# EAGLE schematic PowerController (EAGLE 6.6.0)

## Sheet 1 of 2: MCU
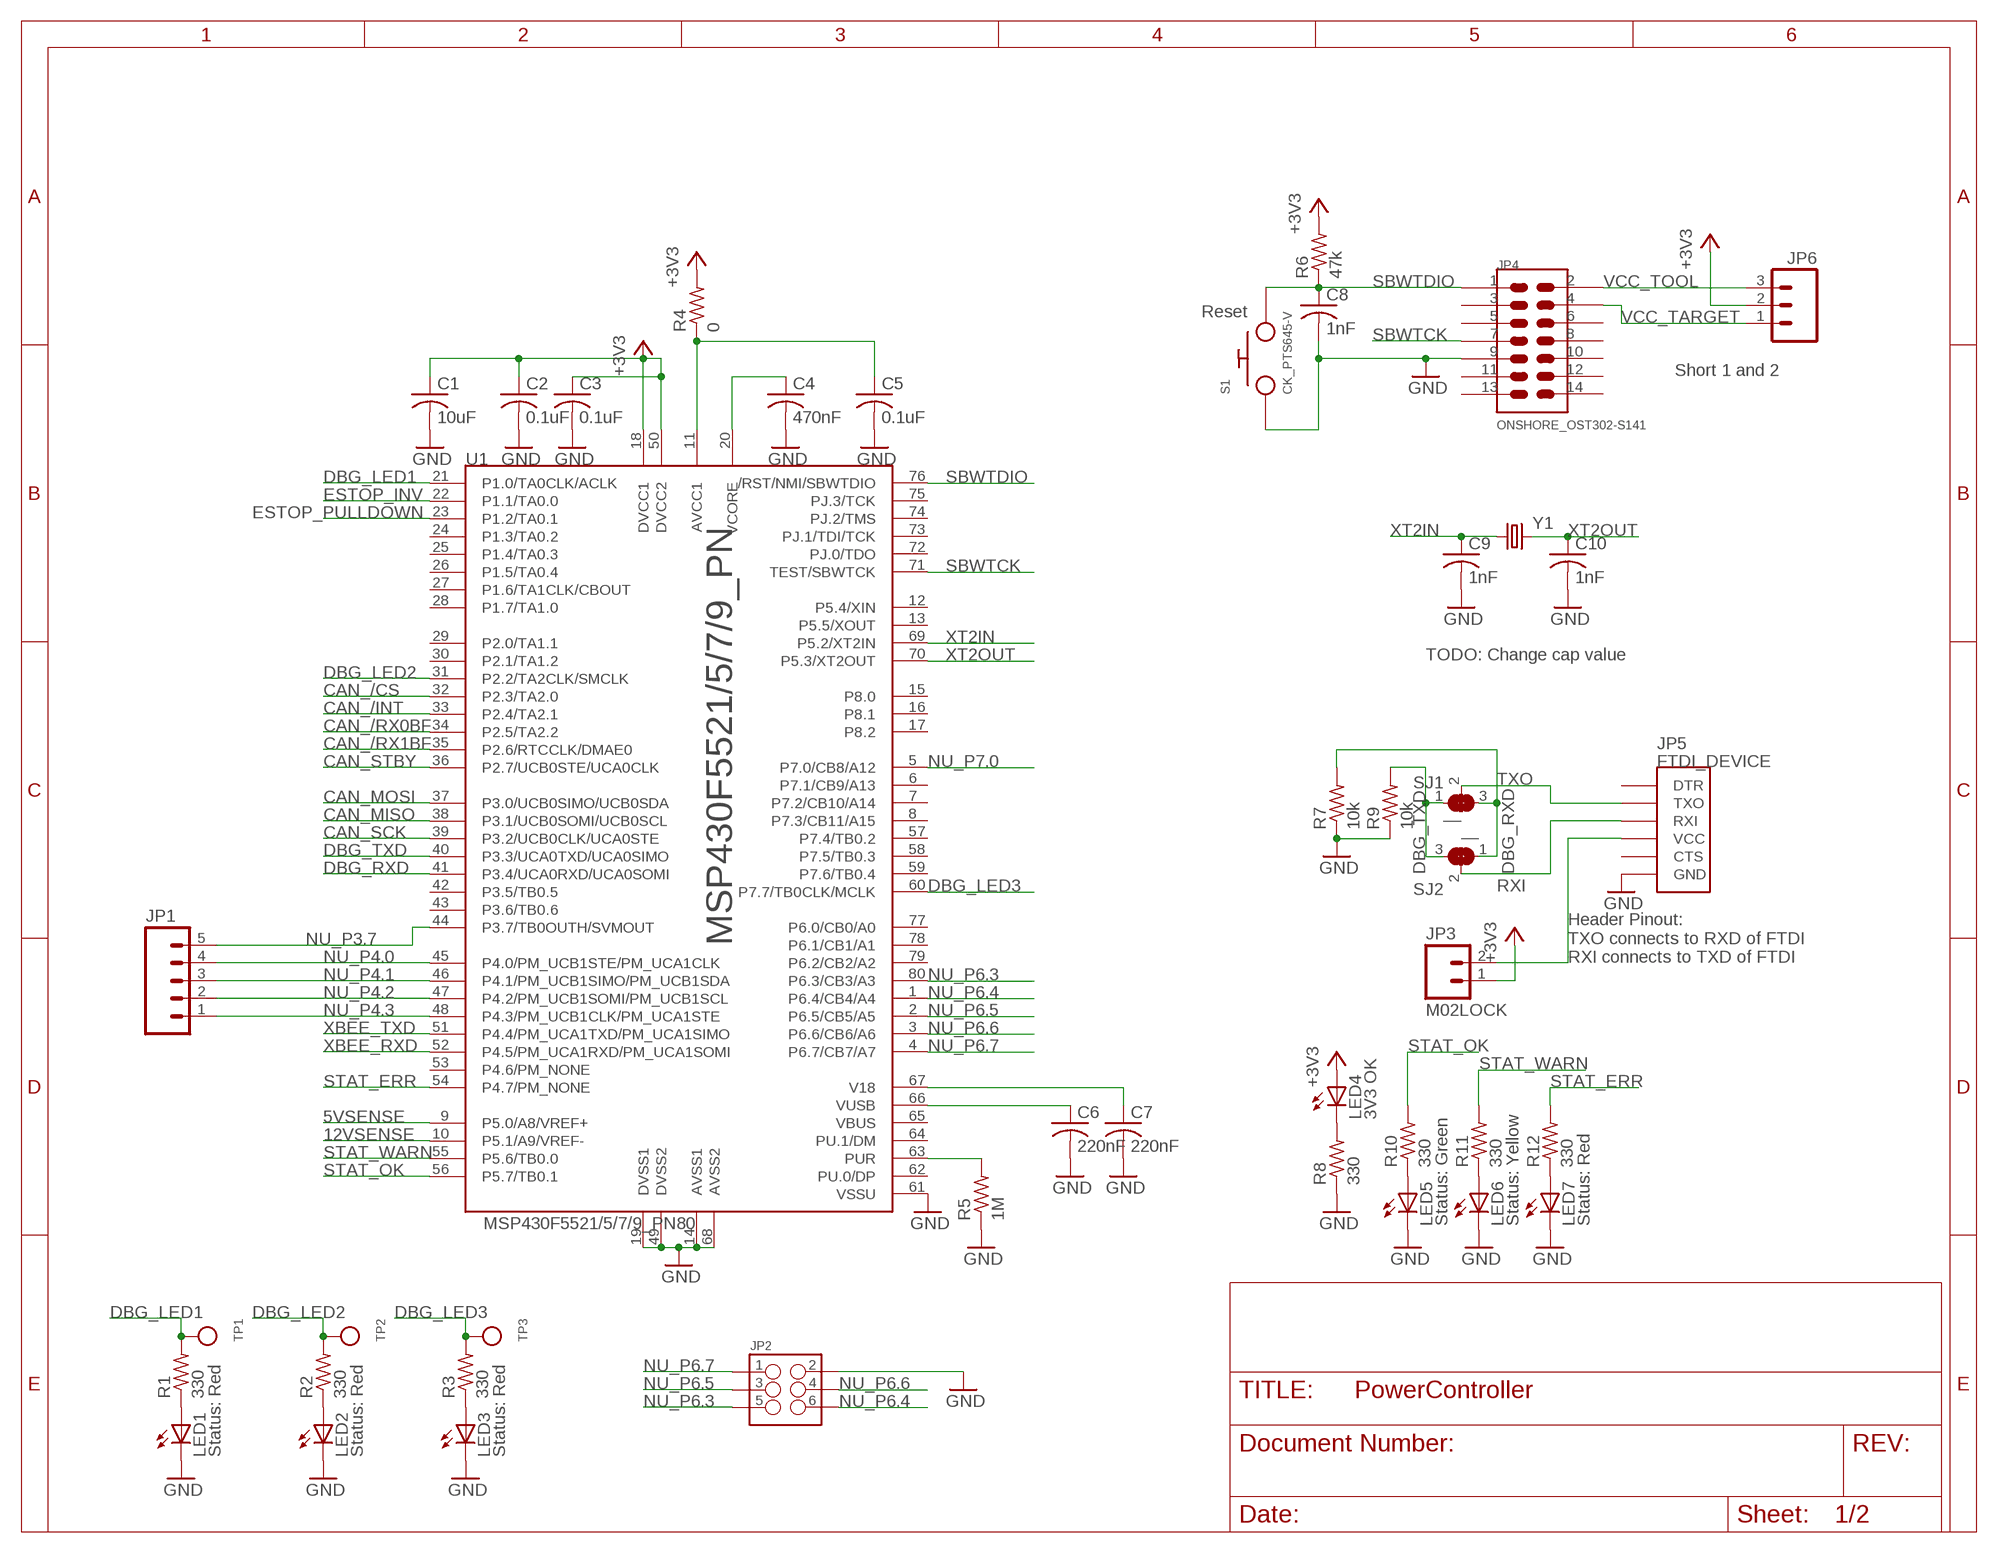
[diagram p0: schematic, sheet 1]

### Parts
C1  10uF  C-USC0805  [C0805]
C2  0.1uF  C-USC0603  [C0603]
C3  0.1uF  C-USC0603  [C0603]
C4  470nF  C-USC0603  [C0603]
C5  0.1uF  C-USC0603  [C0603]
C6  220nF  C-USC0603  [C0603]
C7  220nF  C-USC0603  [C0603]
C8  1nF  C-USC0603  [C0603]
C9  1nF  C-USC0603  [C0603]
C10  1nF  C-USC0603  [C0603]
JP1  M05PTH  [1X05]
JP2  M03X22X3_SILK_SM  [2X3]
JP3  M02LOCK  [1X02_LOCK]
JP4  ONSHORE_OST302-S141  [ONSHORE_OST302-S141]
JP5  FTDI_DEVICE  [FTDI_DEVICE_SIDE]
JP6  M03LOCK  [1X03_LOCK]
LED1  Status: Red  LED0603  [LED-0603]
LED2  Status: Red  LED0603  [LED-0603]
LED3  Status: Red  LED0603  [LED-0603]
LED4  3V3 OK  LED0603  [LED-0603]
LED5  Status: Green  LED0603  [LED-0603]
LED6  Status: Yellow  LED0603  [LED-0603]
LED7  Status: Red  LED0603  [LED-0603]
R1  330  R-US_R0603  [R0603]
R2  330  R-US_R0603  [R0603]
R3  330  R-US_R0603  [R0603]
R4  0  R-US_R0603  [R0603]
R5  1M  R-US_R0603  [R0603]
R6  47k  R-US_R0603  [R0603]
R7  10k  R-US_R0603  [R0603]
R8  330  R-US_R0603  [R0603]
R9  10k  R-US_R0603  [R0603]
R10  330  R-US_R0603  [R0603]
R11  330  R-US_R0603  [R0603]
R12  330  R-US_R0603  [R0603]
S1  CK_PTS645-V  [CK_PTS645-V]
SJ1  SOLDERJUMPER_2WAY0603  [SOLDERJUMPER_2WAY_OPEN_0603]
SJ2  SOLDERJUMPER_2WAY0603  [SOLDERJUMPER_2WAY_OPEN_0603]
TP1  TESTPOINT0.1"  [1X01_ROUND]
TP2  TESTPOINT0.1"  [1X01_ROUND]
TP3  TESTPOINT0.1"  [1X01_ROUND]
U1  MSP430F5521/5/7/9_PN80  [PN80]
Y1  CRYSTALHC49UV  [HC49U-V]

### Nets
5VSENSE: U1.9(P5.0/A8/VREF+) ; also sheet 2
12VSENSE: U1.10(P5.1/A9/VREF-) ; also sheet 2
+3V3: C1.1 C2.1 C3.1 JP3.1 JP6.2 LED4.A R4.2 R6.2 U1.18(DVCC1) U1.50(DVCC2) ; also sheet 2
AVCC: C5.1 R4.1 U1.11(AVCC1)
CAN_/CS: U1.32(P2.3/TA2.0) ; also sheet 2
CAN_/INT: U1.33(P2.4/TA2.1) ; also sheet 2
CAN_/RX0BF: U1.34(P2.5/TA2.2) ; also sheet 2
CAN_/RX1BF: U1.35(P2.6/RTCCLK/DMAE0) ; also sheet 2
CAN_MISO: U1.38(P3.1/UCB0SOMI/UCB0SCL) ; also sheet 2
CAN_MOSI: U1.37(P3.0/UCB0SIMO/UCB0SDA) ; also sheet 2
CAN_SCK: U1.39(P3.2/UCB0CLK/UCA0STE) ; also sheet 2
CAN_STBY: U1.36(P2.7/UCB0STE/UCA0CLK) ; also sheet 2
DBG_LED1: R1.2 TP1.1 U1.21(P1.0/TA0CLK/ACLK)
DBG_LED2: R2.2 TP2.1 U1.31(P2.2/TA2CLK/SMCLK)
DBG_LED3: R3.2 TP3.1 U1.60(P7.7/TB0CLK/MCLK)
DBG_RXD: R7.2 SJ1.3 SJ2.1 U1.41(P3.4/UCA0RXD/UCA0SOMI)
DBG_TXD: R9.2 SJ1.1 SJ2.3 U1.40(P3.3/UCA0TXD/UCA0SIMO)
ESTOP_INV: U1.22(P1.1/TA0.0) ; also sheet 2
ESTOP_PULLDOWN: U1.23(P1.2/TA0.1) ; also sheet 2
GND: C1.2 C2.2 C3.2 C4.2 C5.2 C6.2 C7.2 C8.2 C9.2 C10.2 JP2.2 JP4.9 JP5.P$6(GND) LED1.C LED2.C LED3.C LED5.C LED6.C LED7.C R5.1 R7.1 R8.1 R9.1 S1.1 U1.14(AVSS1) U1.19(DVSS1) U1.49(DVSS2) U1.61(VSSU) U1.68(AVSS2) ; also sheet 2
N$1: JP3.2 JP5.P$4(VCC)
N$2: LED4.C R8.2
N$3: LED5.A R10.1
N$4: LED6.A R11.1
N$5: LED7.A R12.1
N$6: LED1.A R1.1
N$7: R5.2 U1.63(PUR)
N$8: LED2.A R2.1
N$36: LED3.A R3.1
NU_P3.7: JP1.5 U1.44(P3.7/TB0OUTH/SVMOUT)
NU_P4.0: JP1.4 U1.45(P4.0/PM_UCB1STE/PM_UCA1CLK)
NU_P4.1: JP1.3 U1.46(P4.1/PM_UCB1SIMO/PM_UCB1SDA)
NU_P4.2: JP1.2 U1.47(P4.2/PM_UCB1SOMI/PM_UCB1SCL)
NU_P4.3: JP1.1 U1.48(P4.3/PM_UCB1CLK/PM_UCA1STE)
NU_P6.3: JP2.5 U1.80(P6.3/CB3/A3)
NU_P6.4: JP2.6 U1.1(P6.4/CB4/A4)
NU_P6.5: JP2.3 U1.2(P6.5/CB5/A5)
NU_P6.6: JP2.4 U1.3(P6.6/CB6/A6)
NU_P6.7: JP2.1 U1.4(P6.7/CB7/A7)
NU_P7.0: U1.5(P7.0/CB8/A12)
RXI: JP5.P$3(RXI) SJ2.2
SBWTCK: JP4.7 U1.71(TEST/SBWTCK)
SBWTDIO: C8.1 JP4.1 R6.1 S1.2 U1.76(/RST/NMI/SBWTDIO)
STAT_ERR: R12.2 U1.54(P4.7/PM_NONE)
STAT_OK: R10.2 U1.56(P5.7/TB0.1)
STAT_WARN: R11.2 U1.55(P5.6/TB0.0)
TXO: JP5.P$2(TXO) SJ1.2
V18: C7.1 U1.67(V18)
VCC_TARGET: JP4.4 JP6.1
VCC_TOOL: JP4.2 JP6.3
VCORE: C4.1 U1.20(VCORE)
VUSB: C6.1 U1.66(VUSB)
XBEE_RXD: U1.52(P4.5/PM_UCA1RXD/PM_UCA1SOMI) ; also sheet 2
XBEE_TXD: U1.51(P4.4/PM_UCA1TXD/PM_UCA1SIMO) ; also sheet 2
XT2IN: C9.1 U1.69(P5.2/XT2IN) Y1.1
XT2OUT: C10.1 U1.70(P5.3/XT2OUT) Y1.2
Unconnected: JP4.3 JP4.5 JP4.6 JP4.8 JP4.10 JP4.11 JP4.12 JP4.13 JP4.14 JP5.P$1(DTR) JP5.P$5(CTS) U1.6(P7.1/CB9/A13) U1.7(P7.2/CB10/A14) U1.8(P7.3/CB11/A15) U1.12(P5.4/XIN) U1.13(P5.5/XOUT) U1.15(P8.0) U1.16(P8.1) U1.17(P8.2) U1.24(P1.3/TA0.2) U1.25(P1.4/TA0.3) U1.26(P1.5/TA0.4) U1.27(P1.6/TA1CLK/CBOUT) U1.28(P1.7/TA1.0) U1.29(P2.0/TA1.1) U1.30(P2.1/TA1.2) U1.42(P3.5/TB0.5) U1.43(P3.6/TB0.6) U1.53(P4.6/PM_NONE) U1.57(P7.4/TB0.2) U1.58(P7.5/TB0.3) U1.59(P7.6/TB0.4) U1.62(PU.0/DP) U1.64(PU.1/DM) U1.65(VBUS) U1.72(PJ.0/TDO) U1.73(PJ.1/TDI/TCK) U1.74(PJ.2/TMS) U1.75(PJ.3/TCK) U1.77(P6.0/CB0/A0) U1.78(P6.1/CB1/A1) U1.79(P6.2/CB2/A2)

### Notes on the sheet
- Reset
- Short 1 and 2
- TODO: Change cap value
- Header Pinout:
  TXO connects to RXD of FTDI
  RXI connects to TXD of FTDI

## Sheet 2 of 2: External
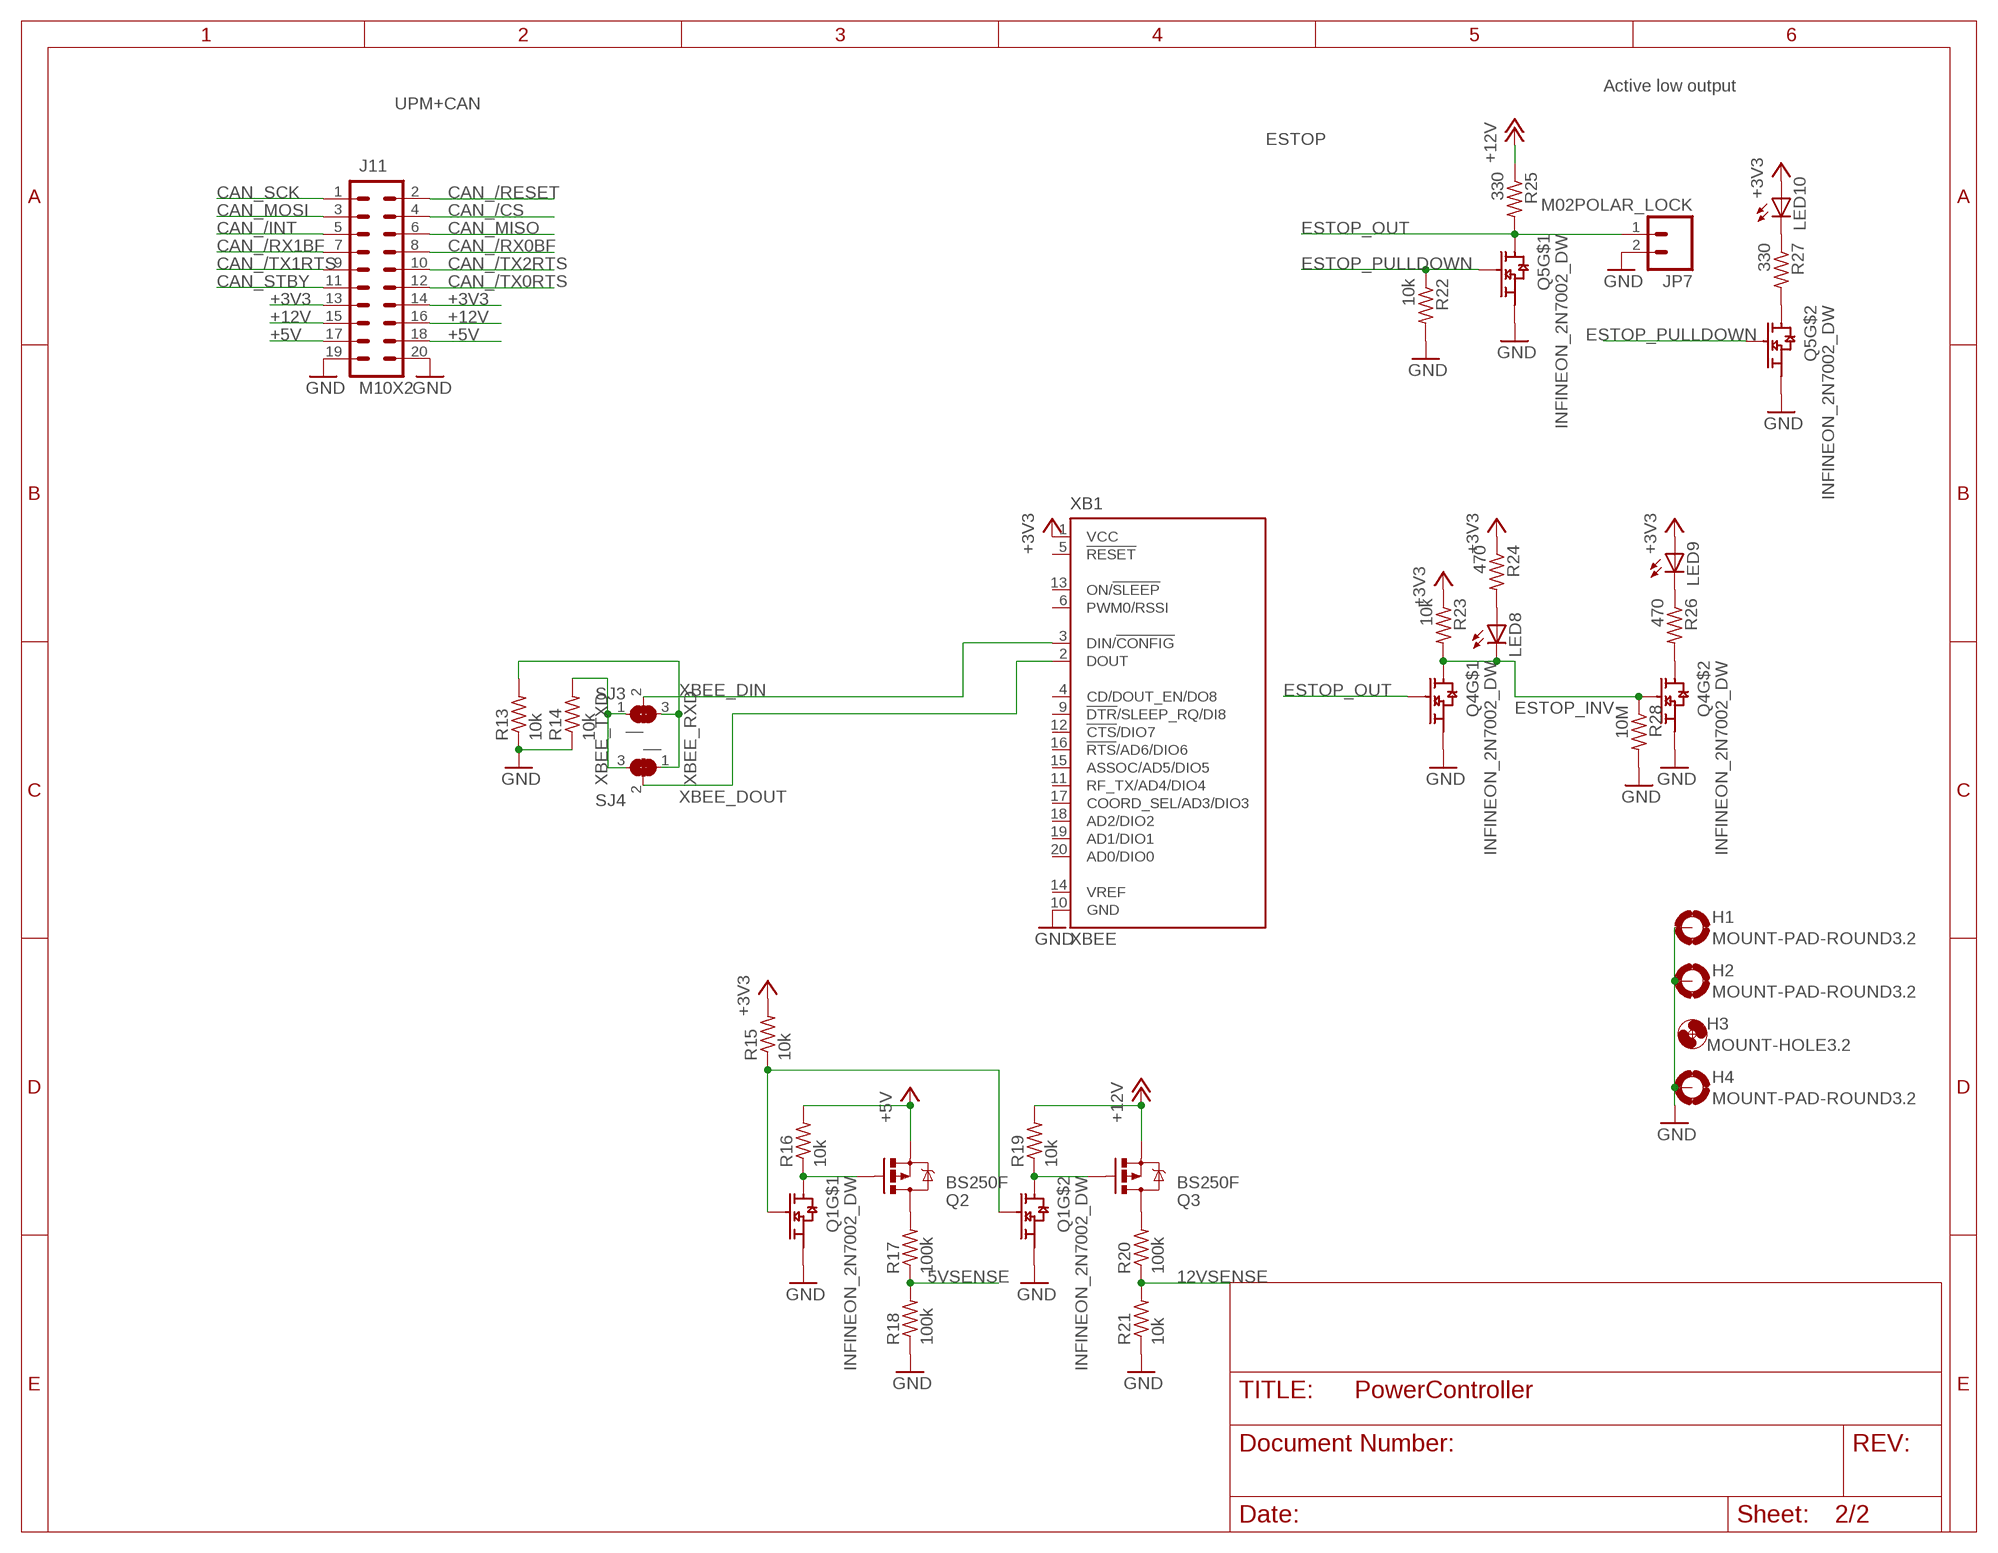
[diagram p1: schematic, sheet 2]

### Parts
H1  MOUNT-PAD-ROUND3.2  [3,2-PAD]
H2  MOUNT-PAD-ROUND3.2  [3,2-PAD]
H3  MOUNT-HOLE3.2  [3,2]
H4  MOUNT-PAD-ROUND3.2  [3,2-PAD]
J11  M10X2  [2X10]
JP7  M02POLAR_LOCK  [MOLEX-1X2_LOCK]
LED8  LED0603  [LED-0603]
LED9  LED0603  [LED-0603]
LED10  LED0603  [LED-0603]
Q1  INFINEON_2N7002_DW  [INFINEON_SOT363]
Q2  BS250F  MOSFET-PCHANNELSMD  [SOT23-3]
Q3  BS250F  MOSFET-PCHANNELSMD  [SOT23-3]
Q4  INFINEON_2N7002_DW  [INFINEON_SOT363]
Q5  INFINEON_2N7002_DW  [INFINEON_SOT363]
R13  10k  R-US_R0603  [R0603]
R14  10k  R-US_R0603  [R0603]
R15  10k  R-US_R0603  [R0603]
R16  10k  R-US_R0603  [R0603]
R17  100k  R-US_R0603  [R0603]
R18  100k  R-US_R0603  [R0603]
R19  10k  R-US_R0603  [R0603]
R20  100k  R-US_R0603  [R0603]
R21  10k  R-US_R0603  [R0603]
R22  10k  R-US_R0603  [R0603]
R23  10k  R-US_R0603  [R0603]
R24  470  R-US_R0603  [R0603]
R25  330  R-US_R0603  [R0603]
R26  470  R-US_R0603  [R0603]
R27  330  R-US_R0603  [R0603]
R28  10M  R-US_R0603  [R0603]
SJ3  SOLDERJUMPER_2WAY0603  [SOLDERJUMPER_2WAY_OPEN_0603]
SJ4  SOLDERJUMPER_2WAY0603  [SOLDERJUMPER_2WAY_OPEN_0603]
XB1  XBEE  [XBEE]

### Nets
5VSENSE: R17.1 R18.2 ; also sheet 1
12VSENSE: R20.1 R21.2 ; also sheet 1
+3V3: J11.13 J11.14 LED9.A LED10.A R15.2 R23.1 R24.1 XB1.1(VCC) ; also sheet 1
+5V: J11.17 J11.18 Q2.2(S) R16.2
+12V: J11.15 J11.16 Q3.2(S) R19.2 R25.1
CAN_/CS: J11.4 ; also sheet 1
CAN_/INT: J11.5 ; also sheet 1
CAN_/RESET: J11.2
CAN_/RX0BF: J11.8 ; also sheet 1
CAN_/RX1BF: J11.7 ; also sheet 1
CAN_/TX0RTS: J11.12
CAN_/TX1RTS: J11.9
CAN_/TX2RTS: J11.10
CAN_MISO: J11.6 ; also sheet 1
CAN_MOSI: J11.3 ; also sheet 1
CAN_SCK: J11.1 ; also sheet 1
CAN_STBY: J11.11 ; also sheet 1
ESTOP_INV: LED8.C Q4.5(GATE) Q4.6(DRAIN) R23.2 R28.1 ; also sheet 1
ESTOP_OUT: JP7.1 Q4.2(GATE) Q5.6(DRAIN) R25.2
ESTOP_PULLDOWN: Q5.2(GATE) Q5.5(GATE) R22.1 ; also sheet 1
GND: H1.B3,2(MOUNT) H2.B3,2(MOUNT) H4.B3,2(MOUNT) J11.19 J11.20 JP7.2 Q1.1(SOURCE) Q1.4(SOURCE) Q4.1(SOURCE) Q4.4(SOURCE) Q5.1(SOURCE) Q5.4(SOURCE) R13.1 R14.1 R18.1 R21.1 R22.2 R28.2 XB1.10(GND) ; also sheet 1
N$9: Q2.3(D) R17.2
N$10: Q1.6(DRAIN) Q2.1(G) R16.1
N$11: Q3.3(D) R20.2
N$12: Q1.2(GATE) Q1.5(GATE) R15.1
N$13: Q5.3(DRAIN) R27.2
N$14: LED10.C R27.1
N$15: LED8.A R24.2
N$16: Q4.3(DRAIN) R26.2
N$17: LED9.C R26.1
VTAP_EN: Q1.3(DRAIN) Q3.1(G) R19.1
XBEE_DIN: SJ3.2 XB1.3(DIN/!CONFIG)
XBEE_DOUT: SJ4.2 XB1.2(DOUT)
XBEE_RXD: R13.2 SJ3.3 SJ4.1 ; also sheet 1
XBEE_TXD: R14.2 SJ3.1 SJ4.3 ; also sheet 1
Unconnected: XB1.4(CD/DOUT_EN/DO8) XB1.5(!RESET) XB1.6(PWM0/RSSI) XB1.9(!DTR!/SLEEP_RQ/DI8) XB1.11(RF_TX/AD4/DIO4) XB1.12(!CTS!/DIO7) XB1.13(ON/!SLEEP) XB1.14(VREF) XB1.15(ASSOC/AD5/DIO5) XB1.16(!RTS!/AD6/DIO6) XB1.17(COORD_SEL/AD3/DIO3) XB1.18(AD2/DIO2) XB1.19(AD1/DIO1) XB1.20(AD0/DIO0)

### Notes on the sheet
- Active low output
- UPM+CAN
- ESTOP

## Library data of the parts
C1-C10 = rcl:C-US: CAPACITOR, American symbol
H1 H2 H4 = holes:MOUNT-PAD-ROUND: MOUNTING PAD, round
H3 = holes:MOUNT-HOLE: MOUNTING HOLE with drill center marker
J11 = SparkFun-Connectors:M10X2: This was SPECIALLY designed to be used with our Graphic LCD Backpack. Be sure you want to use this! It is not only staggered on each line of header holes, but IT IS ALSO offset of the center point of the top and bottom lines by 5 mil. This causes the headers to lock into place on the "standard" footprint on the LCD screen. The extra squares on the tdocu layer are there simply to reference other pins (if you were to actually populate a longer header than ten long - this is what we do with the backpacks).
JP1 = SparkFun-Connectors:M05: Header 5 Standard 5-pin 0.1" header. Use with straight break away headers (SKU : PRT-00116), right angle break away headers (PRT-00553), swiss pins (PRT-00743), machine pins (PRT-00117), and female headers (PRT-00115). Molex polarized connector foot print use with SKU : PRT-08230 with associated crimp pins and housings.
JP2 = SparkFun-Connectors:M03X2: 2x3 .1" header. Shrouded, with keying- CONN-10681 SMT- CONN-11415 Pogo pins- HW-11044
JP3 JP7 = SparkFun-Connectors:M02: Standard 2-pin 0.1" header. Use with - straight break away headers ( PRT-00116) - right angle break away headers (PRT-00553) - swiss pins (PRT-00743) - machine pins (PRT-00117) - female headers (PRT-00115) Molex polarized connector foot print use with: PRT-08233 with associated crimp pins and housings. 2.54_SCREWTERM for use with PRT-10571. 3.5mm Screw Terminal footprints for PRT-08084 5mm Screw Terminal footprints for use with PRT-08433
JP4 = npol-connectors:ONSHORE_OST302-S141
JP5 = SparkFun-Connectors:FTDI_DEVICE: Connector which mates to FTDI basic or FTDI cable.
JP6 = SparkFun-Connectors:M03: Header 3 Standard 3-pin 0.1" header. Use with straight break away headers (SKU : PRT-00116), right angle break away headers (PRT-00553), swiss pins (PRT-00743), machine pins (PRT-00117), and female headers (PRT-00115). Molex polarized connector foot print use with SKU : PRT-08232 with associated crimp pins and housings.
LED1-LED10 = SparkFun-LED:LED: LEDs Standard schematic elements and footprints for 5mm, 3mm, 1206, and 0603 sized LEDs. 5mm - Spark Fun Electronics SKU : COM-00529 (and others)
Q1 Q4 Q5 = npol-discrete:INFINEON_2N7002_DW
Q2 Q3 = SparkFun-DiscreteSemi:MOSFET-PCHANNEL: Generic PMOSFET
R1-R28 = rcl:R-US_: RESISTOR, American symbol
S1 = npol-electromechanical:CK_PTS645-V
SJ1-SJ4 = microbuilder:SOLDERJUMPER_2WAY: 2-Way Solder Jumper
TP1-TP3 = microbuilder:TESTPOINT: Test Point Various test points for characterisation and PCB testing TESTPOINT_SMT - Compact Surface Mount Test Point [Digikey: 5016KTR-ND]; BOM: EXCLUDE
U1 = npol-msp430:MSP430F5521/5/7/9_PN80
XB1 = microbuilder:XBEE: XBee (TM) /XBee-PRO(TM) OEM RF Modules Source: MaxStream, Inc. xbee_productmanual.pdf
Y1 = SparkFun-FreqCtrl:CRYSTAL: Various standard crystals. Proven footprints. Spark Fun Electronics SKU : COM-00534